# Altium project EEWS.PrjPcb
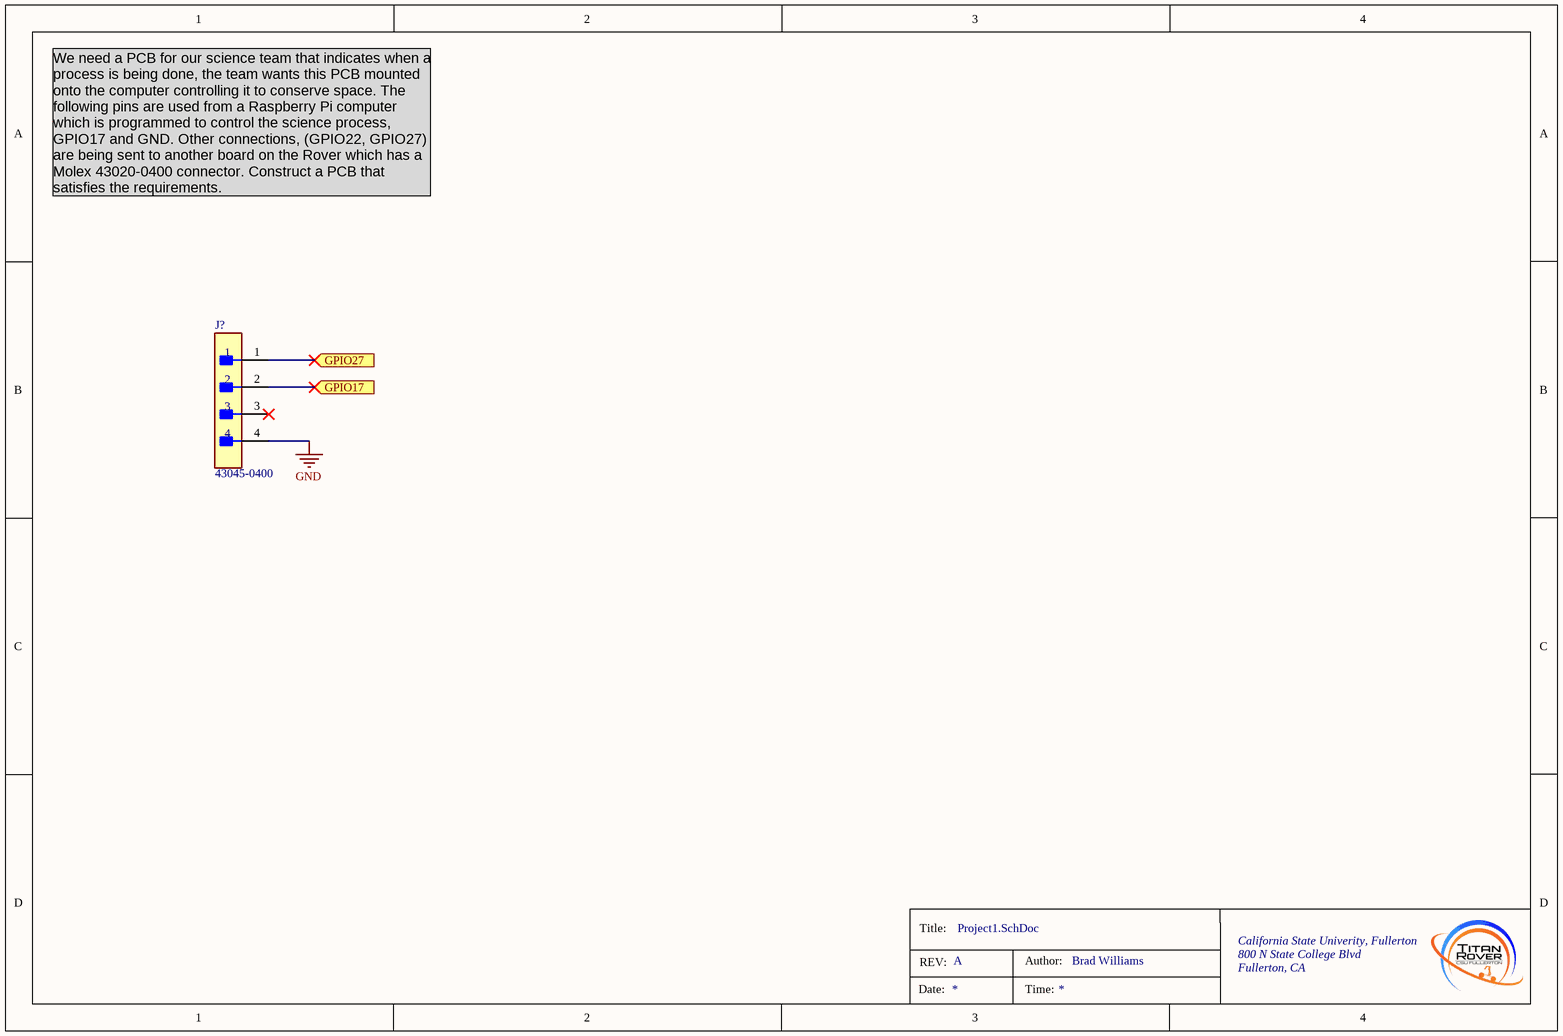
[diagram p0: Project1.SchDoc]
CAGE_CODE: ?????; CAGE_CODE: ?????; CONTRACT_NUMBER: <CONTRACT NO>; CONTRACT_NUMBER: <CONTRACT NO>; DOC_NO_ASSY_DWG: <ASSY DWG NO>; DOC_NO_ASSY_DWG: <ASSY DWG NO>; DOC_NO_BOM: <BOM DOC NO>; DOC_NO_BOM: <BOM DOC NO>; DOC_NO_FAB_DWG: <FAB DWG NO>; DOC_NO_FAB_DWG: <FAB DWG NO>; DOC_NO_SCH_DWG: <SCH DWG NO>; DOC_NO_SCH_DWG: <SCH DWG NO>; PCB_2_DEC_TOL: +/-.01; PCB_2_DEC_TOL: +/-.01; PCB_3_DEC_TOL: +/-.010; PCB_3_DEC_TOL: +/-.010; PCB_ANG_TOL: +/-1/2; PCB_ANG_TOL: +/-1/2; PCB_ASSEMBLY_NO: <PCB ASSY NO>; PCB_ASSEMBLY_NO: <PCB ASSY NO>; PCB_CHECKER: - -----; PCB_CHECKER: - -----; PCB_CHECKER_APP_DATE: --/--/----; PCB_CHECKER_APP_DATE: --/--/----; PCB_DESIGNER: - -----; PCB_DESIGNER: - -----; PCB_DESIGNER_APP_DATE: --/--/----; PCB_DESIGNER_APP_DATE: --/--/----; PCB_DWG_NO: <PCB DWG NO>; PCB_DWG_NO: <PCB DWG NO>; PCB_ENGINEER: - -----; PCB_ENGINEER: - -----; PCB_ENGINEER_APP_DATE: --/--/----; PCB_ENGINEER_APP_DATE: --/--/----; PCB_PART_NUMBER: <PCB PN>; PCB_PART_NUMBER: <PCB PN>; PCB_REV: A; PCB_REV: A; SCH_REV: A; SCH_REV: A
1 sheet, 1 parts. Net scope: flat (ports and power ports of the same name join across sheets).
Board file: PCB1.PcbDoc

## Sheet Project1.SchDoc
size A4

### Parts
J?  43045-0400  [FP-43045-0400-MFG]

### Ports
GPIO17 (in), GPIO27 (in)

### Nets
GND: J?.4
NetJ?_1: J?.1 ; port GPIO27
NetJ?_2: J?.2 ; port GPIO17

Not connected (* = marked no-connect by the designer): J? 3*

### Notes on the sheet
- We need a PCB for our science team that indicates when a process is being done, the team wants this PCB mounted onto the computer controlling it to conserve space. The following pins are used from a Raspberry Pi computer which is programmed to control the science process, GPIO17 and GND. Other connections, (GPIO22, GPIO27) are being sent to another board on the Rover which has a Molex 43020-0400 connector. Construct a PCB that satisfies the requirements.
- Brad Williams
- Title:
- REV:
- Author:
- California State Univerity, Fullerton
- 800 N State College Blvd
- Fullerton, CA
- Date:
- Time:

### Library data of the parts
J? = CMP-04776-000002-1: CONN HEADER R/A 4POS 3MM; Manufacturer: Molex; Conn Gender: Male; Conn Orientation: Right Angle; Voltage Rating: 600V; Number Of Contacts: 4; Is Female: yes; Current Rating: 8.5A; ComponentLink2URL: https://www.molex.com/webdocs/datasheets/pdf/en-us/0430450400_PCB_HEADERS.pdf; Manufacturer Part Number: 43045-0400; Digikey Description: CONN HEADER R/A 4POS 3MM; Category: Conn; Temperature Range High: +105°C; Lead Free: Yes; Device Class L1: Connectors; Automotive: No; Temperature: -40°C to +105°C; Footprint Url: https://www.molex.com/pdm_docs/sd/430450400_sd.pdf; Height: 9.27mm; Number Of Rows: 2; Device Class L3: unset; Pitch: 3mm; Temperature Range Low: -40°C; Contact Material: Tin,Nickel; Octopart: https://octopart.com/43045-0400-molex-287063; RoHS: TRUE; ComponentLink2Description: Datasheet; Package: 43045-0400; Device Class L2: Headers and Wire Housings